# EAGLE design powerboard (EAGLE 7.5.0)
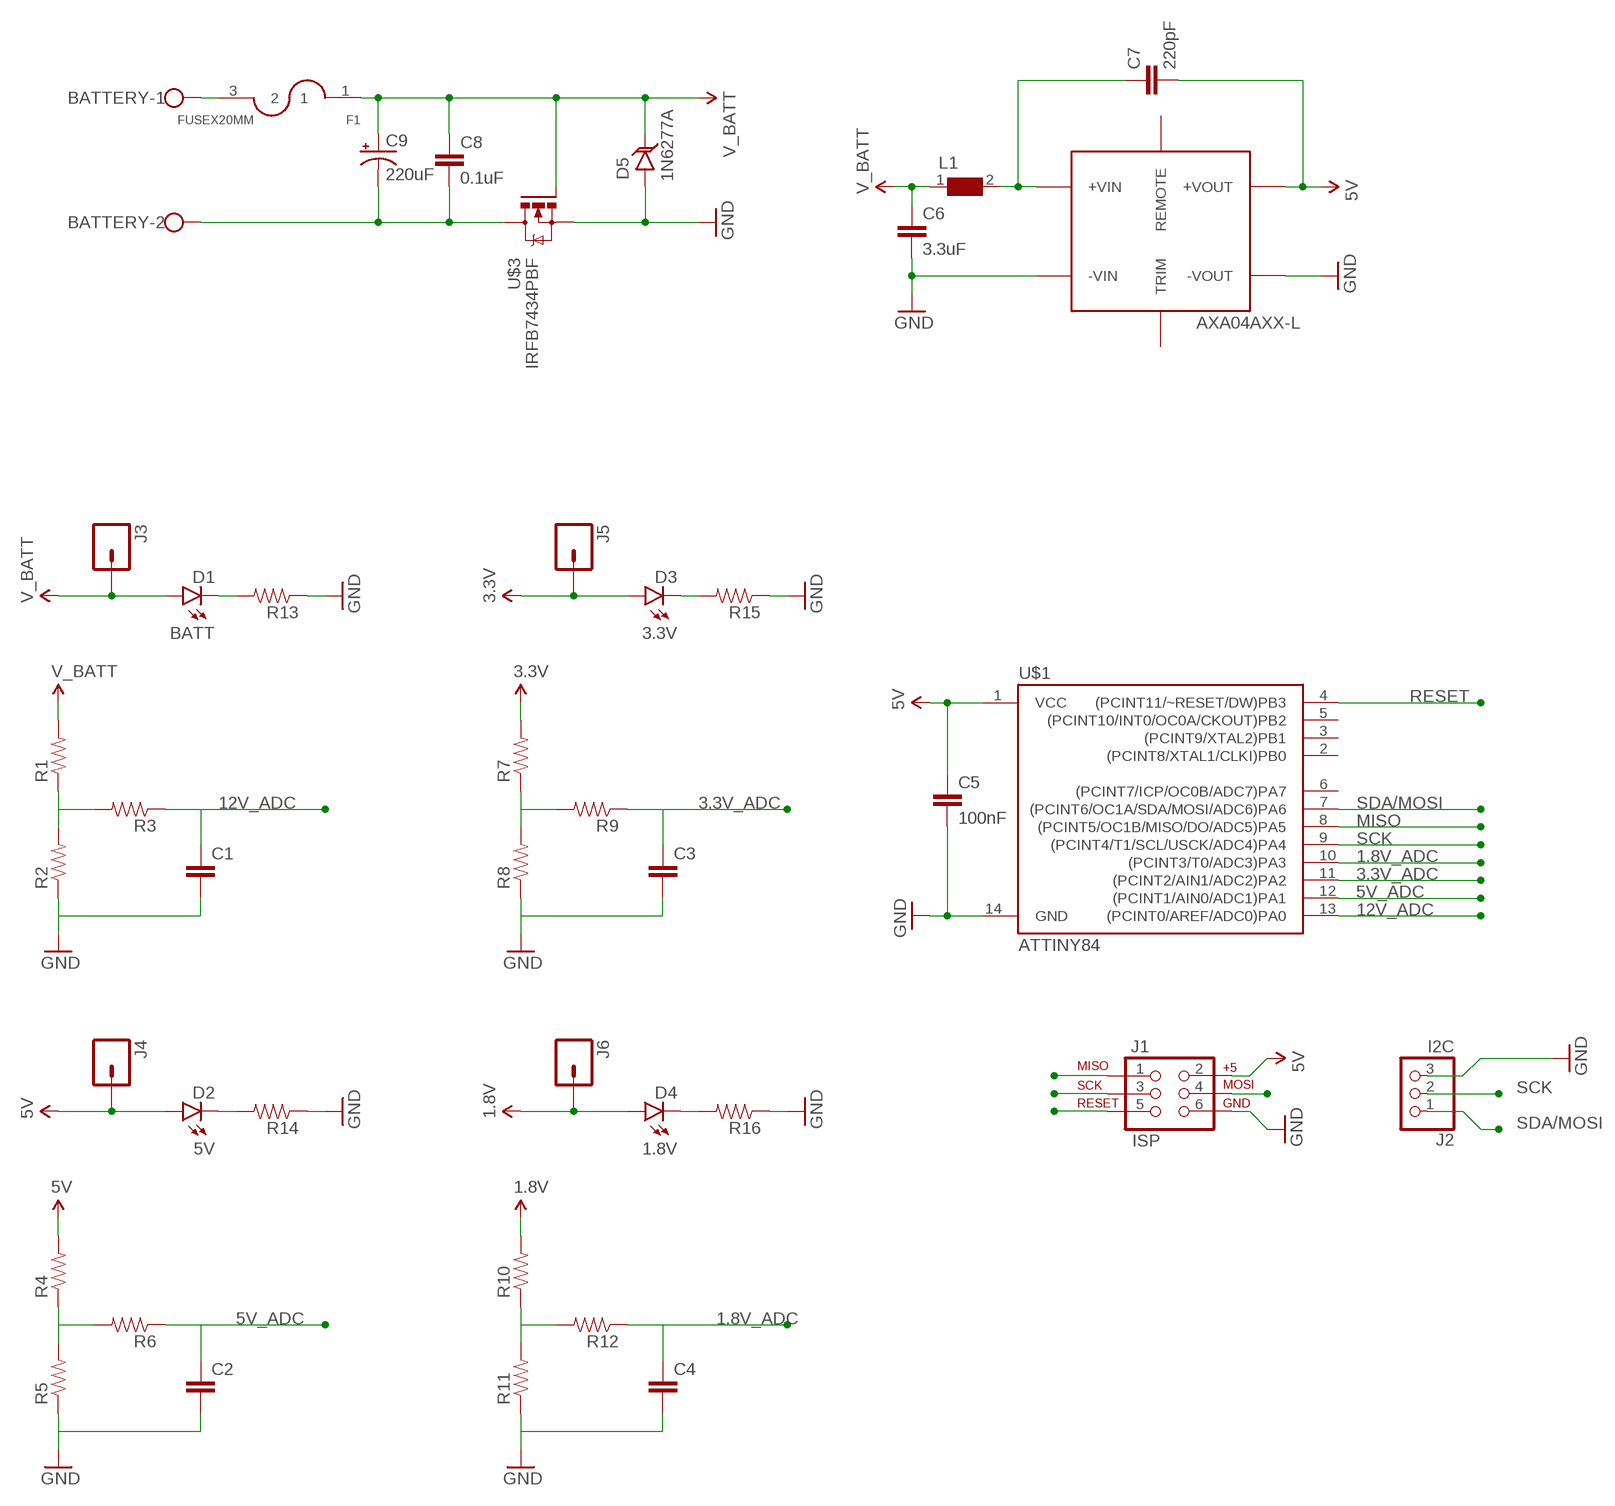
[diagram p0: schematic, sheet 1]

## Parts
BATTERY  W237-102  [W237-102]
C1  CAP0603-CAP  [0603-CAP]
C2  CAP0603-CAP  [0603-CAP]
C3  CAP0603-CAP  [0603-CAP]
C4  CAP0603-CAP  [0603-CAP]
C5  100nF  CAP0603-CAP  [0603-CAP]
C6  3.3uF  CAP1210  [1210]
C7  220pF  C-EUC1808  [C1808]
C8  0.1uF  0.1UF-25V-5%(0603)  [0603-CAP]
C9  220uF  CPOL-USG  [PANASONIC_G]
D1  BATT  LED0603  [LED-0603]
D2  5V  LED0603  [LED-0603]
D3  3.3V  LED0603  [LED-0603]
D4  1.8V  LED0603  [LED-0603]
D5  1N6277A  [1N6277A]
F1  FUSEX20MM  [FUSE_5MM]
J1  ISP  AVR_SPI_PRG_6PTH  [2X3]
J2  I2C  PINHD-1X3/90  [1X03/90]
J3  M01NOSILK-KIT  [1X01NS-KIT]
J4  M01NOSILK-KIT  [1X01NS-KIT]
J5  M01NOSILK-KIT  [1X01NS-KIT]
J6  M01NOSILK-KIT  [1X01NS-KIT]
L1  WE-HCI-744314650_7030/7040/7050  [WE-HCI_7030/7040/7050]
R1  RESISTOR0603-RES  [0603-RES]
R2  RESISTOR0603-RES  [0603-RES]
R3  RESISTOR0603-RES  [0603-RES]
R4  RESISTOR0603-RES  [0603-RES]
R5  RESISTOR0603-RES  [0603-RES]
R6  RESISTOR0603-RES  [0603-RES]
R7  RESISTOR0603-RES  [0603-RES]
R8  RESISTOR0603-RES  [0603-RES]
R9  RESISTOR0603-RES  [0603-RES]
R10  RESISTOR0603-RES  [0603-RES]
R11  RESISTOR0603-RES  [0603-RES]
R12  RESISTOR0603-RES  [0603-RES]
R13  RESISTOR0603-RES  [0603-RES]
R14  RESISTOR0603-RES  [0603-RES]
R15  RESISTOR0603-RES  [0603-RES]
R16  RESISTOR0603-RES  [0603-RES]
U$1  ATTINY84  [SO14]
U$2  AXA04AXX-L  [AXA04AXX-L]
U$3  IRFB7434PBF  [IRFB7434PBF]

## Nets
1.8V: D4.A J6.1 R10.2
1.8V_ADC: C4.1 R12.1 U$1.10((PCINT3/T0/ADC3)PA3)
3.3V: D3.A J5.1 R7.2
3.3V_ADC: C3.1 R9.1 U$1.11((PCINT2/AIN1/ADC2)PA2)
5V: C5.1 C7.2 D2.A J1.2 J4.1 R4.2 U$1.1(VCC) U$2.+VOUT
5V_ADC: C2.1 R6.1 U$1.12((PCINT1/AIN0/ADC1)PA1)
12V_ADC: C1.1 R3.1 U$1.13((PCINT0/AREF/ADC0)PA0)
GND: C1.2 C2.2 C3.2 C4.2 C5.2 C6.2 D5.A J1.6 J2.3 R2.1 R5.1 R8.1 R11.1 R13.1 R14.1 R15.1 R16.1 U$1.14(GND) U$2.-VIN U$2.-VOUT U$3.SOURCE(S)
MISO: J1.1 U$1.8((PCINT5/OC1B/MISO/DO/ADC5)PA5)
N$1: R1.1 R2.2 R3.2
N$2: R4.1 R5.2 R6.2
N$3: R7.1 R8.2 R9.2
N$4: R10.1 R11.2 R12.2
N$5: D1.C R13.2
N$6: D2.C R14.2
N$7: D3.C R15.2
N$8: D4.C R16.2
N$10: C7.1 L1.2 U$2.+VIN
N$11: BATTERY.1 F1.3
N$12: BATTERY.2 C8.2 C9.- U$3.DRAIN(D)
RESET: J1.5 U$1.4((PCINT11/~RESET/DW)PB3)
SCK: J1.3 J2.2 U$1.9((PCINT4/T1/SCL/USCK/ADC4)PA4)
SDA/MOSI: J1.4 J2.1 U$1.7((PCINT6/OC1A/SDA/MOSI/ADC6)PA6)
V_BATT: C6.1 C8.1 C9.+ D1.A D5.C F1.1 J3.1 L1.1 R1.2 U$3.GATE(G)
Unconnected: U$1.2((PCINT8/XTAL1/CLKI)PB0) U$1.3((PCINT9/XTAL2)PB1) U$1.5((PCINT10/INT0/OC0A/CKOUT)PB2) U$1.6((PCINT7/ICP/OC0B/ADC7)PA7) U$2.REMOTE U$2.TRIM/COMMON(TRIM)

## Library data of the parts
BATTERY = con-wago-500:W237-102: WAGO SCREW CLAMP; MPN: 237-102; OC_FARNELL: unknown; OC_NEWARK: 70K9898
C1-C6 = SparkFun-Capacitors:CAP: Capacitor Standard 0603 ceramic capacitor, and 0.1" leaded capacitor.
C7 = resistor:C-EU: CAPACITOR, European symbol
C8 = SparkFun-Capacitors:0.1UF-25V-5%(0603): CAP-08604; PROD_ID: CAP-08604
C9 = rcl:CPOL-US: POLARIZED CAPACITOR, American symbol
D1-D4 = SparkFun-LED:LED: LEDs Standard schematic elements and footprints for 5mm, 3mm, 1206, and 0603 sized LEDs. 5mm - Spark Fun Electronics SKU : COM-00529 (and others)
D5 = powerboard:1N6277A
F1 = SparkFun-Passives:FUSE
J1 = SparkFun-Connectors:AVR_SPI_PRG_6: AVR ISP 6 Pin This is the reduced ISP connector for AVR programming. Common on Arduino. This footprint will take up less PCB space and can be used with a 10-pin to 6-pin adapter such as SKU: BOB-08508 **Special note about "TEST_POINT" package. The stop mask is on the top side, so if you want your programming test points to be on the bottom of your board, make sure to place this package on the bottom side of the board. This also ensure that the orientation to program from the bottom side will be correct.
J2 = pinhead:PINHD-1X3: PIN HEADER
J3-J6 = SparkFun-Connectors:M01: Header 1 Standard 1-pin 0.1" header. Use with straight break away headers (SKU : PRT-00116), right angle break away headers (PRT-00553), swiss pins (PRT-00743), machine pins (PRT-00117), and female headers (PRT-00115). SMTSO-256-ET is a "flush mount" nut for a 4-40 screw. The older package used to be too tight, and did not allow it to sit properly thru the drill hit. The latest (0.165DIA) fits nice and snug.
L1 = WE-HCI:WE-HCI: SMD-Flat Wire High Current Inductor WE-HCI - Flat wire coil for lower losses at high frequency ranges - Low leakage field - Extremely low profile design - Current loading up to 40 A - Magnetically shielded -- Graphic cards -- Laptops -- Motherboards -- High current switching regulators -- Polyphase-switching regulators -- industrial computers; MPN: 744314650; OC_FARNELL: 1636198; OC_NEWARK: 08P2581; PACKAGE: 7050; SUPPLIER: Würth Elektronik eiSos GmbH
R1-R16 = SparkFun-Passives:RESISTOR: Resistor Basic schematic elements and footprints for 0603, 1206, and PTH resistors.
U$1 = SparkFun-DigitalIC:ATTINY84: Atmel 14-pin 2/4/8kB flash uC; PROD_ID: IC-11285
U$2 = powerboard:AXA04AXX-L
U$3 = powerboard:IRFB7434PBF

## Board
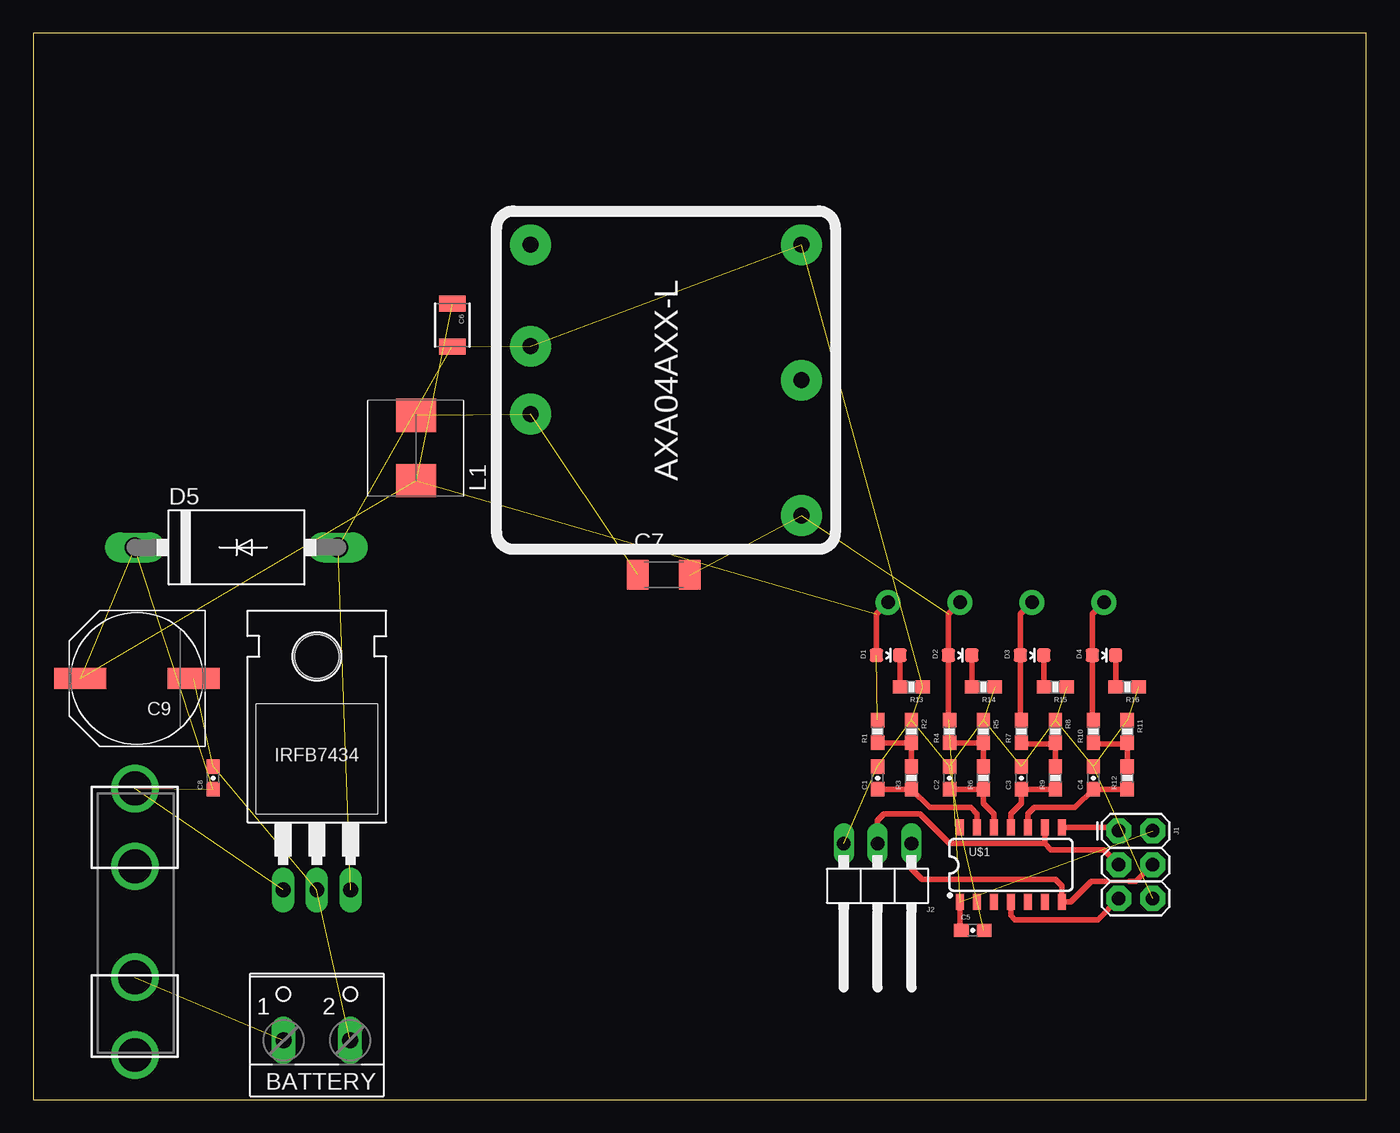
[diagram p1: board, top side]

Size 100 x 80 mm. Coordinates in mm from the lower left corner, seen from the top.
Outline: 0,0 100,0 100,80 0,80 0,0
Copper layers (1*16): Top 0.035mm / dielectric 1.5mm / Bottom 0.035mm
Design rules "default": minimum track width 10mil, minimum drill 24mil, track to track 8mil, track to pad 8mil, pad to pad 8mil, via to via 8mil, smd to smd 8mil, copper to edge 40mil, drill to drill 8mil, minimum pad ring 10mil, minimum via ring 8mil, stop-mask expansion 4mil, vias tented up to drill 0mil, thermal gap 10mil

### Footprints (pad centres in the part's own frame; a part is rotated, then mirrored left to right if it is on the bottom)
W237-102 = drill 1.194 long: 1 -2.5,-1.27; 2 2.5,-1.27
0603-CAP = smd 1.1 x 1: 1 -0.85,0; 2 0.85,0
1210 = smd 1.2 x 2: 1 -1.6,0; 2 1.6,0
C1808 = smd 1.6 x 2.2: 1 -1.95,0; 2 1.95,0
PANASONIC_G = smd 3.9 x 1.6: + 4.25,0; - -4.25,0
LED-0603 = smd 1 x 1: A 0,-0.877; C 0,0.877
1N6277A = drill 1.499 long: A 7.62,0; C -7.62,0
FUSE_5MM = drill 2.54 pad 3.556: 1 0,-10; 2 0,-4.158; 3 0,4.158; 4 0,10
2X3 = drill 1.016 pad 1.88 octagon: 1 0,0; 2 0,2.54; 3 2.54,0; 4 2.54,2.54; 5 5.08,0; 6 5.08,2.54
1X03/90 = drill 1.016 long: 1 -2.54,-3.81; 2 0,-3.81; 3 2.54,-3.81
1X01NS-KIT = drill 1.016 pad 1.88: 1 0,0
WE-HCI_7030/7040/7050 = smd 2.5 x 3: 1 -2.45,0; 2 2.45,0
0603-RES = smd 1.1 x 1: 1 -0.85,0; 2 0.85,0
SO14 = smd 0.6 x 1.2: 1 -3.81,-2.8; 2 -2.54,-2.8; 3 -1.27,-2.8; 4 0,-2.8; 5 1.27,-2.8; 6 2.54,-2.8; 7 3.81,-2.8; 8 3.81,2.8; 9 2.54,2.8; 10 1.27,2.8; 11 0,2.8; 12 -1.27,2.8; 13 -2.54,2.8; 14 -3.81,2.8
AXA04AXX-L = drill 1.2 pad 3.048: +VIN 2.54,-10.16; +VOUT 10.16,10.16; -VIN -2.54,-10.16; -VOUT -10.16,10.16; REMOTE -10.16,-10.16; TRIM/COMMON 0,10.16
IRFB7434PBF = drill 1.118 long: DRAIN 0,-6.35; GATE -2.54,-6.35; SOURCE 2.54,-6.35 | hole 3.302: 0,11.176

### Placement (x,y rotation side)
BATTERY  21.27,5.71 0 top
C1  63.34,24.13 90 top
C2  68.74,24.13 90 top
C3  74.14,24.13 90 top
C4  79.53,24.13 90 top
C5  70.48,12.7 0 top
C6  31.43,58.1 270 top
C7  47.31,39.37 0 top
C8  13.49,24.13 90 top
C9  7.78,31.59 180 top
D1  64.14,33.34 270 top
D2  69.53,33.34 270 top
D3  74.93,33.34 270 top
D4  80.33,33.34 270 top
D5  15.24,41.43 0 top
F1  7.62,13.34 180 top
J1  81.44,20.16 270 top
J2  63.34,15.4 180 top
J3  64.14,37.31 90 top
J4  69.53,37.31 0 top
J5  74.93,37.31 90 top
J6  80.33,37.31 0 top
L1  28.73,48.9 90 top
R1  63.34,27.62 90 top
R2  65.88,27.62 270 top
R3  65.88,24.13 90 top
R4  68.74,27.62 90 top
R5  71.28,27.62 270 top
R6  71.28,24.13 90 top
R7  74.14,27.62 90 top
R8  76.68,27.62 270 top
R9  76.68,24.13 90 top
R10  79.53,27.62 90 top
R11  82.07,27.62 270 top
R12  82.07,24.13 90 top
R13  65.88,30.96 180 top
R14  71.28,30.96 180 top
R15  76.68,30.96 180 top
R16  82.07,30.96 180 top
U$1  73.34,17.62 0 top
U$2  47.47,53.98 270 top
U$3  21.27,22.07 0 top

### Tracks (layer width: path | path; a pad name or v marks a point on that pad's centre or on a via)
1.8V
  Top 0.406: R10.2 79.45,28.47 D4.A 79.45,36.43 J6.1
1.8V_ADC
  Top 0.406: R12.1 C4.1 | U$1.10 74.61,21.43 75.09,21.91 78.16,21.91 C4.1 | C4.1 79.53,23.18
3.3V
  Top 0.406: R7.2 74.05,28.47 D3.A 74.05,36.43 J5.1
3.3V_ADC
  Top 0.406: R9.1 C3.1 74.14,22.23 73.34,21.43 U$1.11
5V  (4 unrouted)
  Top 0.406: R4.2 68.66,28.47 D2.A 68.66,36.43 J4.1 | U$1.1 69.53,12.8 C5.1
5V_ADC
  Top 0.406: C2.1 R6.1 71.28,22.23 72.07,21.43 U$1.12
12V_ADC
  Top 0.406: R3.1 C1.1 | R3.1 65.94,23.28 | U$1.13 70.8,21.43 70.33,21.91 67.25,21.91 R3.1
GND  (20 unrouted)
MISO
  Top 0.406: J1.1 81.18,20.42 U$1.8
N$1
  Top 0.406: R1.1 R2.2 R3.2
N$2
  Top 0.406: R4.1 R5.2 R6.2
N$3
  Top 0.406: R7.1 74.14,26.67 76.57,26.67 R8.2 R9.2
N$4
  Top 0.406: R10.1 79.53,26.67 81.97,26.67 R11.2 R12.2
N$5
  Top 0.406: D1.C 65.01,30.96 R13.2
N$6
  Top 0.406: D2.C 70.41,30.96 R14.2
N$7
  Top 0.406: D3.C 75.81,30.96 R15.2
N$8
  Top 0.406: D4.C 81.2,30.96 R16.2
N$10  (2 unrouted)
N$11  (1 unrouted)
N$12  (3 unrouted)
RESET
  Top 0.406: U$1.4 73.34,13.81 73.66,13.49 79.85,13.49 J1.5
SCK
  Top 0.406: U$1.9 75.88,19.21 | 75.88,19.21 76.36,18.73 80.33,18.73 J1.3 | 75.88,19.21 68.74,19.21 66.52,21.43 63.82,21.43 63.34,20.95 J2.2
SDA/MOSI
  Top 0.254: 80.64,16.35 82.23,16.35
  Top 0.406: 80.64,16.35 79.38,16.35 77.84,14.82 U$1.7 77.15,16.03 76.68,16.51 66.67,16.51 65.88,17.3 J2.1 | 82.23,16.35 82.71,16.35 J1.4
V_BATT  (8 unrouted)
  Top 0.406: D1.A 63.26,36.43 J3.1 | R1.2 63.26,28.47

### Text on the board
tValues: GND | SCK | SDA